# Altium project TIDA-01576_ADS8686S_AFE.PrjPcb (part 2 of 4)

## Sheet TIDA-01576_ADS8686S_AFE_Pg4-5V-15V Split rail converter.SchDoc: 5V-15V Split rail concerter
size 431 x 279 mm; Date: Not shown in title block; ApprovedBy: Not shown in title block; CheckedBy: Not shown in title block; Author: Not shown in title block; CompanyName: Not shown in title block; DrawnBy: Sreenivasa; Engineer: Not shown in title block; Organization: Not shown in title block; Address1: Not shown in title block; Address2: Not shown in title block; Address3: Not shown in title block; Address4: Not shown in title block; DocumentNumber: 1; Revision: Use project parameter SCH_Rev; SheetNumber: 4; SheetTotal: 7; PageSetup: Record=PageOptions|CenterHorizontal=True|CenterVertical=True|PrintScale=1.00|XCorrection=1.00|YCorrection=1.00|PrintKind=0|BorderSize=5000000|LeftOffset=0|BottomOffset=0|Orientation=2|PaperLength=1000|PaperWidth=1000|Scale=100|PaperSource=15|PrintQuality=600|MediaType=1|DitherType=10|PaperKind=Letter|PrintScaleMode=1; CurrentTime: Not shown in title block; CurrentDate: Not shown in title block; Time: Not shown in title block; DocumentFullPathAndName: Not shown in title block; DocumentName: Not shown in title block; ModifiedDate: Not shown in title block; ImagePath: Not shown in title block
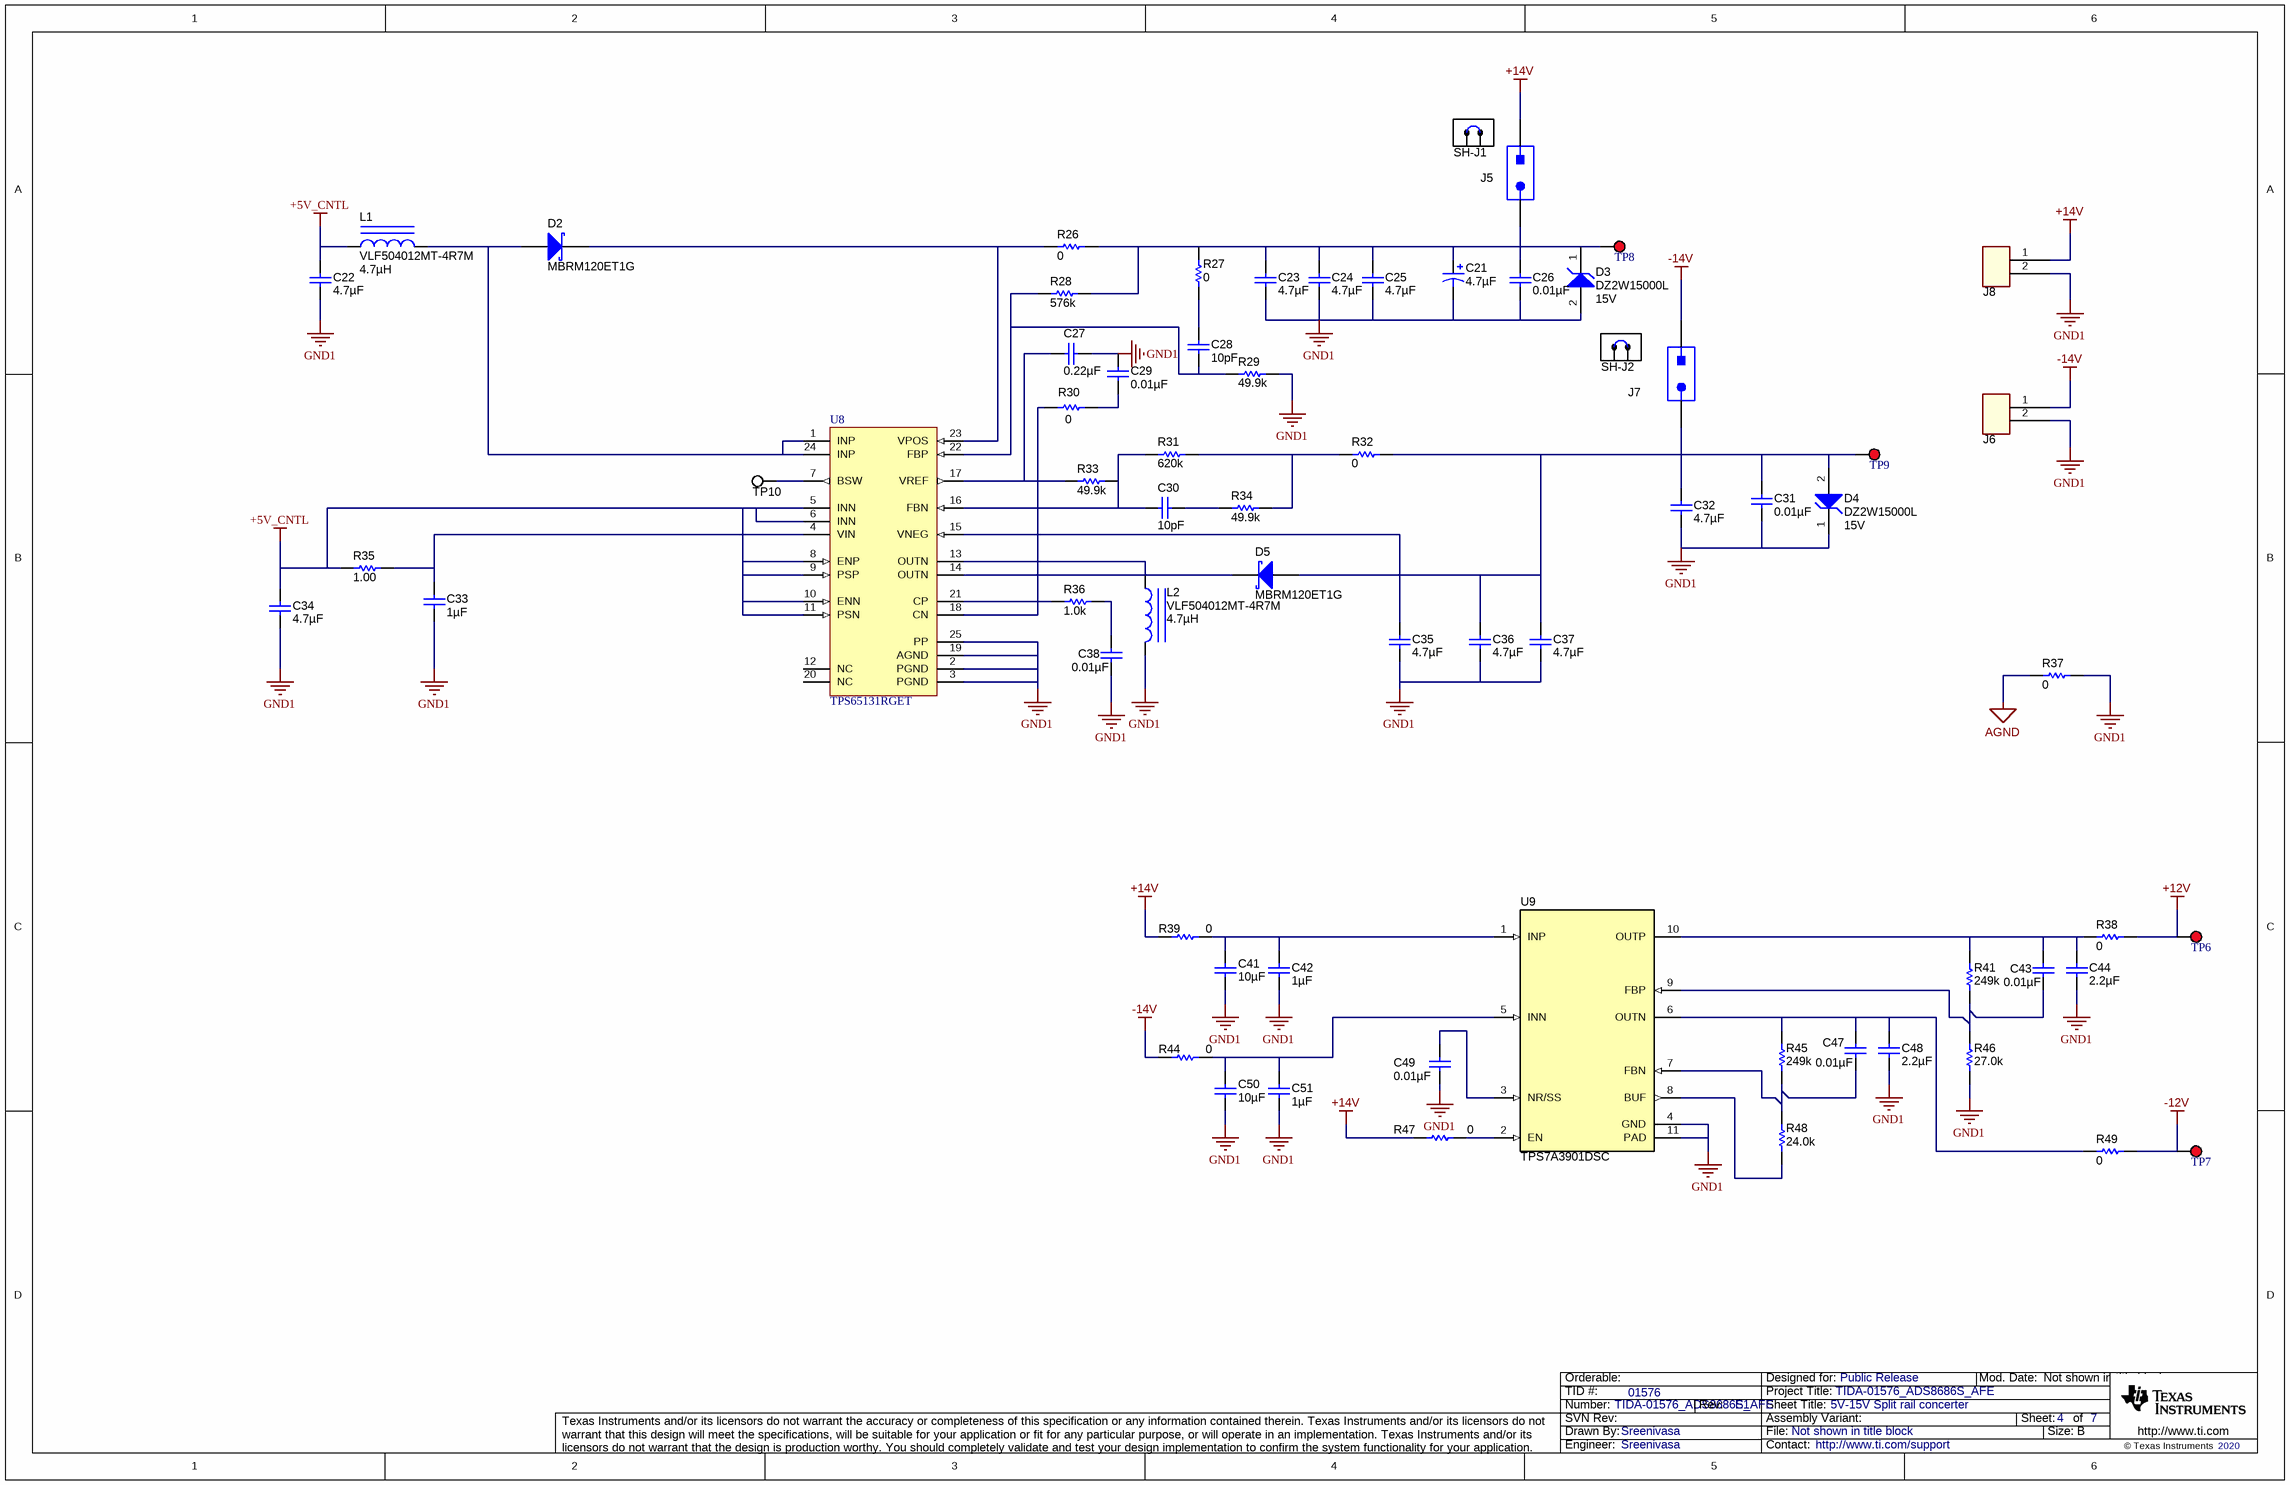
[diagram p3: TIDA-01576_ADS8686S_AFE_Pg4-5V-15V Split rail converter.SchDoc]

### Parts
C21  ValueDisplayed: 4.7µF  [6032-28]  (hidden comment: 293D475X9025C2TE3)
C22  ValueDisplayed: 4.7µF  [1206]  (hidden comment: C3216X7R1E475M160AC)
C23  ValueDisplayed: 4.7µF  [1206]  (hidden comment: C3216X7R1E475M160AC)
C24  ValueDisplayed: 4.7µF  [1206]  (hidden comment: C3216X7R1E475M160AC)
C25  ValueDisplayed: 4.7µF  [1206]  (hidden comment: C3216X7R1E475M160AC)
C26  ValueDisplayed: 0.01µF  [0603]  (hidden comment: GRM188R70J103KA01D)
C27  ValueDisplayed: 0.22µF  [0603]  (hidden comment: C0603C224K9RACTU)
C28  ValueDisplayed: 10pF  [0603]  (hidden comment: C0603C100J5GACTU)
C29  ValueDisplayed: 0.01µF  [0603]  (hidden comment: GRM188R70J103KA01D)
C30  ValueDisplayed: 10pF  [0603]  (hidden comment: C0603C100J5GACTU)
C31  ValueDisplayed: 0.01µF  [0603]  (hidden comment: GRM188R70J103KA01D)
C32  ValueDisplayed: 4.7µF  [1206]  (hidden comment: C3216X7R1E475M160AC)
C33  ValueDisplayed: 1µF  [0603]  (hidden comment: GRM188R61E105KA12D)
C34  ValueDisplayed: 4.7µF  [1206]  (hidden comment: C3216X7R1E475M160AC)
C35  ValueDisplayed: 4.7µF  [1206]  (hidden comment: C3216X7R1E475M160AC)
C36  ValueDisplayed: 4.7µF  [1206]  (hidden comment: C3216X7R1E475M160AC)
C37  ValueDisplayed: 4.7µF  [1206]  (hidden comment: C3216X7R1E475M160AC)
C38  ValueDisplayed: 0.01µF  [0603]  (hidden comment: GRM188R70J103KA01D)
C41  ValueDisplayed: 10µF  [1210]
C42  ValueDisplayed: 1µF  [0603]  (hidden comment: GRM188R61E105KA12D)
C43  ValueDisplayed: 0.01µF  [0603]  (hidden comment: GRM188R70J103KA01D)
C44  ValueDisplayed: 2.2µF  [0805_HV]  (hidden comment: C0805C225K8RACTU)
C47  ValueDisplayed: 0.01µF  [0603]  (hidden comment: GRM188R70J103KA01D)
C48  ValueDisplayed: 2.2µF  [0805_HV]  (hidden comment: C0805C225K8RACTU)
C49  ValueDisplayed: 0.01µF  [0603]  (hidden comment: GRM188R70J103KA01D)
C50  ValueDisplayed: 10µF  [1210]
C51  ValueDisplayed: 1µF  [0603]  (hidden comment: GRM188R61E105KA12D)
D2  MBRM120ET1G  [POWERMITE]
D3  DZ2W15000L  value 15V  [SOD-123]
D4  DZ2W15000L  value 15V  [SOD-123]
D5  MBRM120ET1G  [POWERMITE]
J5  5-146280-2  [TSW-102-07-G-S]  (value not drawn)
J6  CON-OSTVN02A150  [CN2_MTB_P100_PD80_D1.1_S5.54X6.5_STACK]  (value not drawn)
J7  5-146280-2  [TSW-102-07-G-S]  (value not drawn)
J8  CON-OSTVN02A150  [CN2_MTB_P100_PD80_D1.1_S5.54X6.5_STACK]  (value not drawn)
L1  VLF504012MT-4R7M  ValueDisplayed: 4.7µH  [IND_VLF504012]
L2  VLF504012MT-4R7M  ValueDisplayed: 4.7µH  [IND_VLF504012]
R26  value 0  [1206]  (hidden comment: CRCW12060000Z0EA)
R27  ValueDisplayed: 0  [0603]  (hidden comment: CRCW06030000Z0EA)
R28  ValueDisplayed: 576k  [0603]  (hidden comment: CRCW0603576KFKEA)
R29  ValueDisplayed: 49.9k  [0603]  (hidden comment: RG1608P-4992-B-T5)
R30  ValueDisplayed: 0  [0603]  (hidden comment: CRCW06030000Z0EA)
R31  ValueDisplayed: 620k  [0603]  (hidden comment: CRCW0603620KFKEA)
R32  ValueDisplayed: 0  [0603]  (hidden comment: CRCW06030000Z0EA)
R33  ValueDisplayed: 49.9k  [0603]  (hidden comment: RG1608P-4992-B-T5)
R34  ValueDisplayed: 49.9k  [0603]  (hidden comment: RG1608P-4992-B-T5)
R35  ValueDisplayed: 1.00  [0603]  (hidden comment: CR0603-J/-1R0ELF)
R36  ValueDisplayed: 1.0k  [0603]  (hidden comment: CRCW06031K00JNEA)
R37  value 0  [0805_HV]  (hidden comment: CRCW08050000Z0EA)
R38  ValueDisplayed: 0  [0603]  (hidden comment: CRCW06030000Z0EA)
R39  ValueDisplayed: 0  [0603]  (hidden comment: CRCW06030000Z0EA)
R41  ValueDisplayed: 249k  [0603]  (hidden comment: CRCW0603249KFKEA)
R44  ValueDisplayed: 0  [0603]  (hidden comment: CRCW06030000Z0EA)
R45  ValueDisplayed: 249k  [0603]  (hidden comment: CRCW0603249KFKEA)
R46  ValueDisplayed: 27.0k  [0603]  (hidden comment: RC0603FR-0727KL)
R47  ValueDisplayed: 0  [0603]  (hidden comment: CRCW06030000Z0EA)
R48  ValueDisplayed: 24.0k  [0603]  (hidden comment: RC0603FR-0724KL)
R49  ValueDisplayed: 0  [0603]  (hidden comment: CRCW06030000Z0EA)
SH-J1  881545-2  [TE_881545-2]  (value not drawn)  (mechanical)
SH-J2  881545-2  [TE_881545-2]  (value not drawn)  (mechanical)
TP6  5000  [Keystone5000]  (value not drawn)
TP7  5000  [Keystone5000]  (value not drawn)
TP8  5000  [Keystone5000]  (value not drawn)
TP9  5000  [Keystone5000]  (value not drawn)
TP10  5002  [Keystone5002]  (value not drawn)
U8  TPS65131RGET  [RGE0024B]
U9  TPS7A3901DSC  [DSC0010J]

### Nets
+5V_CNTL: C22.1 C34.1 L1.1 R35.1 U8.5(INN) U8.6(INN) U8.8(ENP) U8.9(PSP) U8.10(ENN) U8.11(PSN)
+12V: R38.2 TP6.1
+14V: J5.1 J8.1 R39.1 R47.1
-12V: R49.2 TP7.1
-14V: J6.1 J7.1 R44.1
AGND: R37.1
GND1: C21.2(-) C22.2 C23.2 C24.2 C25.2 C26.2 C27.1 C29.1 C31.2 C32.2 C33.2 C34.2 C35.2 C36.2 C37.2 C38.2 C41.1 C42.2 C44.2 C48.2 C49.2 C50.1 C51.2 D3.2(A) D4.1(K) J6.2 J8.2 L2.2 R29.2 R37.2 R46.1 U8.2(PGND) U8.3(PGND) U8.19(AGND) U8.25(PP) U9.4(GND) U9.11(PAD)
NetC21_1: C21.1(+) C23.1 C24.1 C25.1 C26.1 D3.1(K) J5.2 R26.2 R27.2 R28.2 TP8.1
NetC27_2: C27.2 R33.1 U8.17(VREF)
NetC28_1: C28.1 R27.1
NetC28_2: C28.2 R28.1 R29.1 U8.22(FBP)
NetC29_2: C29.2 R30.2
NetC30_1: C30.1 R34.1
NetC30_2: C30.2 R31.1 R33.2 U8.16(FBN)
NetC31_1: C31.1 C32.1 C35.1 C36.1 C37.1 D4.2(A) D5.2(A) J7.2 R32.2 TP9.1 U8.15(VNEG)
NetC33_1: C33.1 R35.2 U8.4(VIN)
NetC38_1: C38.1 R36.2
NetC41_2: C41.2 C42.1 R39.2 U9.1(INP)
NetC43_1: C43.1 C44.1 R38.1 R41.2 U9.10(OUTP)
NetC43_2: C43.2 R41.1 R46.2 U9.9(FBP)
NetC47_1: C47.1 C48.1 R45.2 R49.1 U9.6(OUTN)
NetC47_2: C47.2 R45.1 R48.2 U9.7(FBN)
NetC49_1: C49.1 U9.3(NR/SS)
NetC50_2: C50.2 C51.1 R44.2 U9.5(INN)
NetD2_1: D2.1(K) R26.1 U8.23(VPOS)
NetD2_2: D2.2(A) L1.2 U8.1(INP) U8.24(INP)
NetD5_1: D5.1(K) L2.1 U8.13(OUTN) U8.14(OUTN)
NetR30_1: R30.1 U8.18(CN)
NetR31_2: R31.2 R32.1 R34.2
NetR36_1: R36.1 U8.21(CP)
NetR47_2: R47.2 U9.2(EN)
NetR48_1: R48.1 U9.8(BUF)
NetTP10_1: TP10.1 U8.7(BSW)

Not connected (* = marked no-connect by the designer): U8 12(NC) 20(NC)

### Notes on the sheet
- Drawn By:
- SVN Rev:
- Number:
- TID #:
- Orderable:
- Rev:
- Sheet Title:
- File:
- Project Title:
- Designed for:
- Assembly Variant:
- Mod. Date:
- Sheet:
- Size:
- of
- B
- http://www.ti.com
- Texas Instruments and/or its licensors do not warrant the accuracy or completeness of this specification or any information contained therein. Texas Instruments and/or its licensors do not warrant that this design will meet the specifications, will be suitable for your application or fit for any particular purpose, or will operate in an implementation. Texas Instruments and/or its licensors do not warrant that the design is production worthy. You should completely validate and test your design implementation to confirm the system functionality for your application.
- Engineer:
- Contact:
- © Texas Instruments

### Library data of the parts
C21 = 293D475X9025C2TE3: CAP, TA, 4.7 µF, 25 V, +/- 10%, 2 ohm, SMD; Manufacturer: Vishay-Sprague; Polarized: Y; CompType: Capacitor; Value: 4.7uF; U/M: EA; Cap_F: 0.0000047; Tolerance_%: 10; Value1: 2 ohm; VDC_V: 25; Value2: 25V; ESR_ohm: 2; IRMS_A: 0.24; TaMin_C: -55; TaMax_C: 125; Cap_Case: C; SymbolVersion: 2008-07-09; PartNumber: 293D475X9025C2TE3; PackageReference: 6032-28; RoHS: Y; MountType: SMT; Technology: TA; Series: 293D; Publisher: Texas Instruments; LatestRevisionDate: 2014-11-20; LatestRevisionNote: Updated supplier links; ComponentLink1Description: Datasheet link; ComponentLink1URL: http://www.vishay.com/docs/40002/293d.pdf; Supplier 1: Digi-Key; Supplier Part Number 1: 718-1082-1-ND; Supplier 2: Mouser; Supplier Part Number 2: 74-293D475X9025C2TE3; Supplier 3: Farnell; Supplier Part Number 3: 1754216
C22-C25 C32 C34-C37 = C3216X7R1E475M: CAP, CERM, 4.7 µF, 25 V, +/- 20%, X7R, 1206; Manufacturer: TDK; Polarized: N; CompType: Capacitor; Value: 4.7uF; U/M: EA; Cap_F: 0.0000047; Tolerance_%: 20; ESR_ohm: 0.0063; Value1: 0.0063 ohm; VDC_V: 25; Value2: 25V; TaMin_C: -55; TaMax_C: 125; SymbolVersion: 2008-07-09; PartNumber: C3216X7R1E475M160AC; PackageReference: 1206; RoHS: Y; MountType: SMT; Technology: Ceramic; TempCo: X7R; Cap_Case: 1206; Published: 2008-06-19; Publisher: Texas Instruments; LatestRevisionDate: 2015-02-10; ComponentLink1Description: Datasheet link; ComponentLink1URL: http://www.tdk.co.jp/tefe02/e412_c.pdf; Supplier 1: Digi-Key; Supplier Part Number 1: 445-1424-1-ND; Supplier 2: Farnell; Supplier Part Number 2: 1844330
C26 C29 C31 C38 C43 C47 C49 = GRM188R70J103KA01D: CAP, CERM, 0.01 µF, 6.3 V, +/- 10%, X7R, 0603; Manufacturer: MuRata; Polarized: N; CompType: Capacitor; Value: 0.01uF; U/M: EA; Cap_F: 0.00000001; Tolerance_%: 10; Value1: Unknown; VDC_V: 6.3; Value2: 6.3V; TaMin_C: -55; TaMax_C: 125; SymbolVersion: 2008-07-09; PartNumber: GRM188R70J103KA01D; PackageReference: 0603; RoHS: Y; MountType: SMT; Technology: Ceramic; TempCo: X7R; Cap_Case: 0603; Published: 2008-06-19; Publisher: Texas Instruments; LatestRevisionDate: 2015-02-10; ComponentLink1Description: Datasheet link; ComponentLink1URL: http://search.murata.co.jp/Ceramy/PnsearchViewAction.do?HnOFG=ON&HnNFG=ON&SEL_CNT=50&sLang=en&sKey=GRM188R70J103KA01D&x=9&y=9&search=startwith; Supplier 1: Digi-Key; Supplier Part Number 1: 490-9729-1-ND; Supplier 2: Mouser; Supplier Part Number 2: 81-GRM188R70J103KA1D
C27 = C0603C224K4RACTU: CAP, CERM, 0.22 µF, 6.3 V, +/- 10%, X7R, 0603; Manufacturer: Kemet; Polarized: N; CompType: Capacitor; Value: 0.22uF; U/M: EA; Cap_F: 0.00000022; Tolerance_%: 10; Value1: Unknown; VDC_V: 16; Value2: 16V; TaMin_C: -55; TaMax_C: 125; SymbolVersion: 2008-07-09; PartNumber: C0603C224K9RACTU; PackageReference: 0603; RoHS: Y; MountType: SMT; Technology: Ceramic; TempCo: X7R; Cap_Case: 0603; Published: 2008-06-19; Publisher: Texas Instruments; LatestRevisionDate: 2014-05-15; ComponentLink1Description: Datasheet link; ComponentLink1URL: http://www.kemet.com/kemet/web/homepage/kechome.nsf/vapubfiles/F3102_Y5V.pdf/$file/F3102_Y5V.pdf; Supplier 1: Digi-Key; Supplier Part Number 1: 399-9046-1-ND; Supplier 2: Mouser; Supplier Part Number 2: 80-C0603C224K4R; Supplier 3: Farnell; Supplier Part Number 3: 1650007
C28 C30 = C0603C100J5GACTU: CAP, CERM, 10 pF, 50 V, +/- 5%, C0G/NP0, 0603; Manufacturer: Kemet; Polarized: N; CompType: Capacitor; Value: 10pF; U/M: EA; Cap_F: 0.00000000001; Tolerance_%: 5; Value1: Unknown; VDC_V: 50; Value2: 50V; TaMin_C: -55; TaMax_C: 125; SymbolVersion: 2008-07-09; PartNumber: C0603C100J5GACTU; PackageReference: 0603; RoHS: Y; MountType: SMT; Technology: Ceramic; TempCo: C0G/NP0; Cap_Case: 0603; Published: 2008-06-19; Publisher: Texas Instruments; LatestRevisionDate: 2015-02-10; ComponentLink1Description: Datasheet link; ComponentLink1URL: http://www.kemet.com/kemet/web/homepage/kechome.nsf/vapubfiles/F3102_Y5V.pdf/$file/F3102_Y5V.pdf; Supplier 1: Digi-Key; Supplier Part Number 1: 399-1049-1-ND; Supplier 2: Mouser; Supplier Part Number 2: 80-C0603C100J5G; Supplier 3: Farnell; Supplier Part Number 3: 1414601
C33 C42 C51 = GRM188R61E105KA12D: CAP, CERM, 1 µF, 25 V, +/- 10%, X5R, 0603; Manufacturer: MuRata; Polarized: N; CompType: Capacitor; Value: 1uF; U/M: EA; Cap_F: 0.000001; Tolerance_%: 10; Value1: Unknown; VDC_V: 25; Value2: 25V; TaMin_C: -55; TaMax_C: 85; SymbolVersion: 2008-07-09; PartNumber: GRM188R61E105KA12D; PackageReference: 0603; RoHS: Y; MountType: SMT; Technology: Ceramic; TempCo: X5R; Cap_Case: 0603; Published: 2008-06-19; Publisher: Texas Instruments; LatestRevisionDate: 2015-02-10; ComponentLink1Description: Datasheet link; ComponentLink1URL: http://search.murata.co.jp/Ceramy/PnsearchViewAction.do?HnOFG=ON&HnNFG=ON&SEL_CNT=50&sLang=en&sKey=GRM188R61E105KA12D&x=9&y=9&search=startwith; Supplier 1: Digi-Key; Supplier Part Number 1: 490-3897-1-ND; Supplier 2: Mouser; Supplier Part Number 2: 81-GRM188R61E105KA12; Supplier 3: Farnell; Supplier Part Number 3: 1828802
C41 C50 = GMK325AB7106MM-T: CAP, CERM, 10uF, 35V, +/-20%, X7R, 1210; Manufacturer: Taiyo Yuden; Polarized: N; CompType: Capacitor; U/M: EA; Cap_F: 0.00001; Tolerance_%: 20; Value1: Unknown; VDC_V: 35; TaMin_C: -55; TaMax_C: 125; PackageReference: 1210; PartNumber: GMK325AB7106MM-T; SymbolVersion: 2008-07-09; Value: 10uF; RoHS: Y; Value2: 35V; MountType: SMT; Technology: Ceramic; Cap_Case: 1210; Publisher: Texas Instruments; LatestRevisionDate: 2013-12-06; ComponentLink1Description: Datasheet link; ComponentLink1URL: http://www.yuden.co.jp/productdata/catalog/en/mlcc01_e.pdf; Supplier 1: Digi-Key; Supplier Part Number 1: 587-2779-1-ND; Supplier 2: Mouser; Supplier Part Number 2: 963-GMK325AB7106MM-T; Supplier 3: Farnell; Supplier Part Number 3: 1894510; TempCo: X7R; Published: 2008-06-19
C44 C48 = C0805C225K8RACTU: CAP, CERM, 2.2uF, 10V, +/-10%, X7R, 0805; Manufacturer: Kemet; Polarized: N; CompType: Capacitor; U/M: EA; Cap_F: 0.0000022; Tolerance_%: 10; ESR_Ohm: 0.008; Value1: 0.008 ohm; IRMS_A: 15.55; TaMin_C: -55; TaMax_C: 125; Cap_Case: 0805; SymbolVersion: 2008-07-09; Value: 2.2uF; PartNumber: C0805C225K8RACTU; PackageReference: 0805; RoHS: Y; VDC_V: 10; Value2: 10V; MountType: SMT; Technology: Ceramic; TempCo: X7R; Published: 2008-06-19; Publisher: Texas Instruments; LatestRevisionDate: 2014-05-28; ComponentLink1Description: Datasheet link; ComponentLink1URL: http://www.kemet.com/kemet/web/homepage/kechome.nsf/file/Partial%20Copy%20-%20Ceramic%20Surface%20Mount%20Capacitors/$file/F3102_CE.pdf; Supplier 1: Digi-Key; Supplier Part Number 1: 399-3522-1-ND; Supplier 2: Mouser; Supplier Part Number 2: 80-C0805C225K8R
D2 D5 = MBRM120ET1G: Diode, Schottky, 20 V, 1 A, POWERMITE; Manufacturer: ON Semiconductor; U/M: EA; Vf_V: 0.53; Value: 20V; Value1: 1A; Value2: 0.53V; Io_A: 1; Vr_V: 20; CompType: Diode; SymbolVersion: 2008-12-08; PartNumber: MBRM120ET1G; PackageReference: POWERMITE; MountType: SMT; Type: Schottky; Published: 2008-06-26; Publisher: Texas Instruments; LatestRevisionDate: 2015-02-10; ComponentLink1Description: Datasheet link; ComponentLink1URL: http://www.onsemi.com/pub_link/Collateral/MBRM120E-D.PDF; Supplier 1: Digi-Key; Supplier Part Number 1: MBRM120ET3GOSCT-ND
D3 D4 = DZ2W15000L: Diode, Zener, 15V, 1W, SOD-123; Manufacturer: Panasonic; CompType: Zener; PartNumber: DZ2W15000L; PackageReference: SOD-123; MountType: SMT; RoHS: Y; ComponentLink1Description: Datasheet link; ComponentLink1URL: http://www.semicon.panasonic.co.jp/ds4/DZ2W150_E.pdf; Publisher: Texas Instruments; Supplier 1: Digi-Key; Supplier Part Number 1: DZ2W15000LCT-ND
J5 J7 = TSW-102-07-G-S: Header, 100mil, 2x1, Gold, TH; Manufacturer: TE Connectivity; SymbolCreator: a0412235; U/M: EA; SymbolVersion: 2013-10-31; PartNumber: 5-146280-2; ClassName: Header; PackageReference: 2x1 Header; CompType: Header; RoHS: Y; MountType: TH; ComponentLink1Description: Datasheet Link; ComponentLink1URL: http://samtec.com/ftppub/pdf/TSW_TH.PDF; Publisher: Texas Instruments; LatestRevisionDate: 2015-10-21; Supplier 1: Digi-Key; Supplier Part Number 1: A121480-ND
J6 J8 = CON-OSTVN02A150: Terminal Block, 4x1, 2.54mm, TH; Manufacturer: On Shore Technology Inc; SymbolCreator: x0120606; PartNumber: OSTVN02A150; CompType: Terminal Block; Publisher: TI; Alternate Manufacturer: *; PackageReference: TERM_BLK, 2pos, 2.54mm; Supplier 1: Digi-Key; RoHS: Y; MountType: TH; ComponentLink1URL: http://www.on-shore.com/sites/default/files/manuals/ostvnxxa150.pdf; ComponentLink1Description: Datasheet Link; Alternate PartNumber: *; Supplier Part Number 1: ED10561-ND
L1 L2 = VLF504012MT-4R7M: Inductor, Shielded, Ferrite, 4.7uH, 1.83A, 0.1 ohm, SMD; Manufacturer: TDK; Ind_H: 4.7E-6; Imax_A: 1.83; Irms: 1.83A @ 40C rise; Isat: 1.94A @ 30% inductance drop; DCR_ohm: 0.1; Value1: 0.1 ohm; U/M: EA; SymbolVersion: 2008-07-23; CompType: Inductor; Value: 4.7uH; PartNumber: VLF504012MT-4R7M; PackageReference: IND_5x1.2x4mm; Value2: 1.83A; Technology: Shielded; MountType: SMT; Material: Ferrite; Published: 2008-06-26; Publisher: Texas Instruments; LatestRevisionDate: 2013-10-24; ComponentLink1Description: Datasheet link; ComponentLink1URL: http://www.tdk.co.jp/tefe02/e531_vlf.pdf; RoHS: Y; Supplier 1: Digi-Key; Supplier Part Number 1: 445-17203-1-ND
R26 = CRCW12060000Z0EA: RES, 0 ohm, 5%, 0.25W, 1206; Manufacturer: Vishay-Dale; CompType: Resistor; Value_Code: 0000; Tolerance_%: 5; Power_W: 0.25; VDC_V: 200; TempCo: 200 ppm/C; EIA_Code: E24; U/M: EA; SymbolVersion: 2009-05-29; PartNumber: CRCW12060000Z0EA; PackageReference: 1206; RoHS: Y; Res_ohm: 0; Value1: 5%; Value2: 0.25W; MountType: SMT; Technology: Thick Film; Published: 2008-06-26; Publisher: Texas Instruments; LatestRevisionDate: 2013-10-09; ComponentLink1Description: Datasheet link; ComponentLink1URL: http://www.vishay.com/docs/20035/dcrcwe3.pdf; Supplier 1: Digi-Key; Supplier Part Number 1: 541-0.0ECT-ND; Supplier 2: Mouser; Supplier Part Number 2: 71-CRCW1206-0-E3; Supplier 3: Farnell; Supplier Part Number 3: 1469963
R27 R30 R32 R38 R39 R44 R47 R49 = CRCW06030000Z0EA: RES, 0, 5%, 0.1 W, 0603; Manufacturer: Vishay-Dale; CompType: Resistor; Value: 0; Value_Code: 0000; Tolerance_%: 5; Power_W: 0.1; Value2: 0.1W; VDC_V: 75; TempCo: 200 ppm/C; EIA_Code: E24; U/M: EA; SymbolVersion: 2009-05-29; PartNumber: CRCW06030000Z0EA; PackageReference: 0603; RoHS: Y; Res_ohm: 0; Value1: 5%; MountType: SMT; Technology: Thick Film; Published: 2008-06-26; Publisher: Texas Instruments; LatestRevisionDate: 2014-12-16; ComponentLink1Description: Datasheet link; ComponentLink1URL: http://www.vishay.com/docs/20035/dcrcwe3.pdf; Supplier 1: Digi-Key; Supplier Part Number 1: 541-0.0GCT-ND; Supplier 2: Mouser; Supplier Part Number 2: 71-CRCW0603-0-E3; Supplier 3: Farnell; Supplier Part Number 3: 1469739
R28 = CRCW0603576KFKEA: RES, 576 k, 1%, 0.1 W, 0603; Manufacturer: Vishay-Dale; CompType: Resistor; Value: 576k; Res_ohm: 576000; Tolerance_%: 1; Power_W: 0.1; Value2: 0.1W; VDC_V: 75; TempCo: 100 ppm/C; EIA_Code: E96; U/M: EA; SymbolVersion: 2009-05-29; PartNumber: CRCW0603576KFKEA; PackageReference: 0603; RoHS: Y; Value_Code: 576k; Value1: 1%; MountType: SMT; Technology: Thick Film; Published: 2008-06-26; Publisher: Texas Instruments; LatestRevisionDate: 2014-12-16; ComponentLink1Description: Datasheet link; ComponentLink1URL: http://www.vishay.com/docs/20035/dcrcwe3.pdf; Supplier 1: Digi-Key; Supplier Part Number 1: 541-576KHCT-ND; Supplier 2: Mouser; Supplier Part Number 2: 71-CRCW0603-576K-E3; Supplier 3: Farnell; Supplier Part Number 3: 1878635
R29 R33 R34 = RG1608P-4992-B-T5: RES, 49.9 k, 0.1%, 0.1 W, 0603; Manufacturer: Susumu Co Ltd; CompType: Resistor; Value: 49.9k; Res_ohm: 49900; Value_Code: 49k9; Tolerance_%: 0.1; Value2: 0.1W; VDC_V: 75; TempCo: 25 ppm/C; EIA_Code: E192; U/M: EA; SymbolVersion: 2009-05-29; PartNumber: RG1608P-4992-B-T5; PackageReference: 0603; RoHS: Y; Value1: 0.1%; Power_W: 0.1; MountType: SMT; Technology: Metal Film; Published: 2008-06-26; Publisher: Texas Instruments; LatestRevisionDate: 2014-12-16; ComponentLink1Description: Datasheet link; ComponentLink1URL: http://www.susumu.co.jp/english/pdf/products-j01-01.pdf; Supplier 1: Digi-Key; Supplier Part Number 1: RG16P49.9KBCT-ND; Supplier 2: Mouser; Supplier Part Number 2: 754-RG1608P-4992-BT5; Supplier 3: Farnell; Supplier Part Number 3: 9367926
R31 = RC0603FR-07620KL: RES SMD 620K OHM 1% 1/10W 0603; Manufacturer: Vishay-Dale; CompType: Resistor; Res_ohm: 620000; Tolerance_%: 1; Power_W: 0.1; Value2: 0.1W; VDC_V: 150; TempCo: 200 ppm/C; U/M: EA; SymbolVersion: 2009-05-29; Value: 620k; PartNumber: CRCW0603620KFKEA; PackageReference: 0603; RoHS: Y; Value_Code: 620k; Value1: 1%; MountType: SMT; Technology: Thick Film; Published: 2008-06-26; Publisher: Texas Instruments; LatestRevisionDate: 2014-12-16; ComponentLink1Description: Datasheet link; ComponentLink1URL: http://www.yageo.com/pdf/Pu-RC0603_51_PbFree_L_2.pdf; Supplier 1: Digi-Key; Supplier Part Number 1: 541-620KHCT-ND; Supplier 2: Mouser; Supplier Part Number 2: 603-RC0603FR-07620KL
R35 = RT0603DRE071RL: RES SMD 1 OHM 5% 1/10W 0603; Manufacturer: Bourns inc; CompType: Resistor; Value: 1.00; Res_ohm: 1; Value_Code: 1R00; Tolerance_%: 0.5; Value1: 0.5%; Power_W: 0.1; Value2: 0.1W; VDC_V: 75; TempCo: 50 ppm/C; EIA_Code: E192; U/M: EA; SymbolVersion: 2009-05-29; PartNumber: CR0603-J/-1R0ELF; PackageReference: 0603; RoHS: Y; MountType: SMT; Technology: Thin Film; Published: 2008-06-26; Publisher: Texas Instruments; LatestRevisionDate: 2014-12-16; ComponentLink1Description: Datasheet link; ComponentLink1URL: http://www.yageo.com/pdf/PYu-RT_1-to-0.05_RoHS_L_3.pdf; Supplier 1: Digi-Key; Supplier Part Number 1: CR0603-J/-1R0ELFCT-ND
R36 = CRCW06031K00JNEA: RES, 1.0 k, 5%, 0.1 W, 0603; Manufacturer: Vishay-Dale; CompType: Resistor; Value: 1.0k; Res_ohm: 1000; Value_Code: 1k00; Tolerance_%: 5; Power_W: 0.1; Value2: 0.1W; VDC_V: 75; TempCo: 200 ppm/C; EIA_Code: E24; U/M: EA; SymbolVersion: 2009-05-29; PartNumber: CRCW06031K00JNEA; PackageReference: 0603; RoHS: Y; Value1: 5%; MountType: SMT; Technology: Thick Film; Published: 2008-06-26; Publisher: Texas Instruments; LatestRevisionDate: 2014-12-16; ComponentLink1Description: Datasheet link; ComponentLink1URL: http://www.vishay.com/docs/20035/dcrcwe3.pdf; Supplier 1: Digi-Key; Supplier Part Number 1: 541-1.0KGCT-ND; Supplier 2: Mouser; Supplier Part Number 2: 71-CRCW0603J-1.0K-E3; Supplier 3: Farnell; Supplier Part Number 3: 1652851
R37 = CRCW0805330KJNEA: RES, 0 ohm, 5%, 0.125W, 0805; Manufacturer: Vishay-Dale; CompType: Resistor; Tolerance_%: 5; Power_W: 0.125; VDC_V: 150; TempCo: 200 ppm/C; EIA_Code: E24; U/M: EA; SymbolVersion: 2009-05-29; PartNumber: CRCW08050000Z0EA; PackageReference: 0805; RoHS: Y; Res_ohm: 0; Value_Code: 0; Value1: 5%; Value2: 0.125W; MountType: SMT; Technology: Thick Film; Published: 2008-06-26; Publisher: Texas Instruments; LatestRevisionDate: 2014-04-18; ComponentLink1Description: Datasheet link; ComponentLink1URL: http://www.vishay.com/docs/20035/dcrcwe3.pdf; Supplier 1: Digi-Key; Supplier Part Number 1: 541-0.0ACT-ND
R41 R45 = CRCW0603249KFKEA: RES, 249 k, 1%, 0.1 W, 0603; Manufacturer: Vishay-Dale; CompType: Resistor; Value: 249k; Res_ohm: 249000; Tolerance_%: 1; Power_W: 0.1; Value2: 0.1W; VDC_V: 75; TempCo: 100 ppm/C; SizeArea_mm2: 1.28; SizeX_mm: 1.6; SizeY_mm: 0.8; EIA_Code: E96; U/M: EA; AEC Category: Q200; SymbolVersion: 2009-05-29; PartNumber: CRCW0603249KFKEA; PackageReference: 0603; RoHS: Y; Value_Code: 249k; Value1: 1%; MountType: SMT; Technology: Thick Film; SizeZ_mm: 1; Published: 2008-06-26; Publisher: Texas Instruments; LatestRevisionDate: 2016-06-29; ComponentLink1Description: Datasheet link; ComponentLink1URL: http://www.vishay.com/docs/20035/dcrcwe3.pdf; Supplier 1: Digi-Key; Supplier Part Number 1: 541-249KHCT-ND; Supplier 2: Mouser; Supplier Part Number 2: 71-CRCW0603-249K-E3; Supplier 3: Farnell; Supplier Part Number 3: 1469787; AEC Qualified: ?
R46 = RC0603FR-0727KL: RES, 27.0 k, 1%, 0.1 W, 0603; Manufacturer: Yageo America; CompType: Resistor; Value: 27.0k; Res_ohm: 27000; Value_Code: 27k0; Tolerance_%: 1; Power_W: 0.1; Value2: 0.1W; VDC_V: 150; TempCo: 200 ppm/C; SizeArea_mm2: 1.28; SizeX_mm: 1.6; SizeY_mm: 0.8; U/M: EA; AEC Category: Q200; Green_Lifecycle: Active; Green_REACh: Passed; SymbolVersion: 2009-05-29; PartNumber: RC0603FR-0727KL; PackageReference: 0603; RoHS: Y; Value1: 1%; MountType: SMT; Technology: Thick Film; SizeZ_mm: 1; Published: 2008-06-26; Publisher: Texas Instruments; LatestRevisionDate: 2017-05-31; ComponentLink1Description: Datasheet link; ComponentLink1URL: http://www.yageo.com/pdf/Pu-RC0603_51_PbFree_L_2.pdf; Supplier 1: Digi-Key; Supplier Part Number 1: 311-27.0KHRCT-ND; Supplier 2: Mouser; Supplier Part Number 2: 603-RC0603FR-0727KL; Supplier 3: Farnell; Supplier Part Number 3: 9238654; AEC Qualified: ?; Green_EU RoHS: Passed with Exemption; Green_EU RoHS-2: Passed
R48 = RC0603FR-0724KL: RES, 24.0 k, 1%, 0.1 W, 0603; Manufacturer: Yageo America; CompType: Resistor; Value: 24.0k; Res_ohm: 24000; Value_Code: 24k0; Tolerance_%: 1; Power_W: 0.1; Value2: 0.1W; VDC_V: 150; TempCo: 200 ppm/C; SizeArea_mm2: 1.28; SizeX_mm: 1.6; SizeY_mm: 0.8; U/M: EA; AEC Category: Q200; Green_Lifecycle: Active; Green_REACh: Passed; SymbolVersion: 2009-05-29; PartNumber: RC0603FR-0724KL; PackageReference: 0603; RoHS: Y; Value1: 1%; MountType: SMT; Technology: Thick Film; SizeZ_mm: 1; Published: 2008-06-26; Publisher: Texas Instruments; LatestRevisionDate: 2017-05-31; ComponentLink1Description: Datasheet link; ComponentLink1URL: http://www.yageo.com/pdf/Pu-RC0603_51_PbFree_L_2.pdf; Supplier 1: Digi-Key; Supplier Part Number 1: 311-24.0KHRCT-ND; Supplier 2: Mouser; Supplier Part Number 2: 603-RC0603FR-0724KL; Supplier 3: Farnell; Supplier Part Number 3: 1799336; AEC Qualified: ?; Green_EU RoHS: Passed with Exemption; Green_EU RoHS-2: Passed
SH-J1 SH-J2 = 881545-2: Shunt, 100mil, Gold plated, Black; Manufacturer: TE Connectivity; CompType: Shunt; PartNumber: 881545-2; RoHS: Y; PackageReference: Shunt 2 pos. 100 mil; MountType: N/A; ComponentLink1Description: Datasheet Link; ComponentLink1URL: http://www.te.com/commerce/DocumentDelivery/DDEController?Action=srchrtrv&DocNm=881545&DocType=Customer+Drawing&DocLang=English; Publisher: Texas Instruments; LatestRevisionDate: 2014-09-20; Supplier 1: Digi-Key; Supplier Part Number 1: A26242-ND; Supplier 2: Mouser; Supplier Part Number 2: 571-8815452; Supplier 3: Farnell; Supplier Part Number 3: 1654806
TP6-TP9 = 5000: Test Point, Miniature, Red, TH; Manufacturer: Keystone; CompType: Test Point Loop; ContactFinish: Silver; Green_Lifecycle: Active; Green_REACh: Passed; SymbolVersion: 2008-04-04; PartNumber: 5000; RoHS: Y; PackageReference: Red Miniature Testpoint; MountType: TH; ComponentLink1Description: Datasheet URL; ComponentLink1URL: http://www.keyelco.com/userAssets/file/M60-2p60.pdf; Publisher: Texas Instruments; LatestRevisionDate: 2017-05-11; Supplier 1: Digi-Key; Supplier Part Number 1: 36-5000-ND; Supplier 2: Mouser; Supplier Part Number 2: 534-5000; Color: Red; Green_EU RoHS: Passed; Green_EU RoHS-2: Incomplete
TP10 = 5002: Test Point, Miniature, White, TH; Manufacturer: Keystone; CompType: Test Point Loop; U/M: EA; SymbolVersion: 2008-04-04; PartNumber: 5002; PackageReference: White Miniature Testpoint; RoHS: Y; MountType: TH; ComponentLink1Description: Datasheet Link; ComponentLink1URL: http://www.keyelco.com/userAssets/file/M60-2p60.pdf; Value: White; Publisher: Texas Instruments; LatestRevisionDate: 2015-08-25; Supplier 1: Digi-Key; Supplier Part Number 1: 36-5002-ND; Supplier 2: Newark; Supplier Part Number 2: 82H9632
U8 = TPS65131RGET: Postive and Negative Output DC-DC Converter, 2.7 to 5.5 V, -40 to 85 degC, 24-pin QFN (RGE24), Green (RoHS & no Sb/Br); Manufacturer: Texas Instruments; Alternate Manufacturer: None; Alternate PartNumber: Equivalent; Iq(Typ)(mA): 0.5; Rating: Catalog; SubFamily: LCD/OLED Display Bias Solutions; Switching Frequency(Typ)(kHz): 1400; Synchronous Rectification: TRUE; Topology: Boost, Inverting Buck/Boost; Vin(Max)(V): 5.5; Vin(Min)(V): 2.7; DatasheetVersion: SLVS493B; PackageVersion: 4204104/G; PackageReference: RGE0024B; PackageDescription: 24-Pin Plastic Flat Pack, Body 4 x 4 mm, 0.5 mm Pitch; Supplier 1: Digi-Key; Supplier Part Number 1: 296-41760-1-ND; Supplier 2: Digi-Key; Supplier Part Number 2: 296-17349-1-ND; Supplier 3: Digi-Key; Supplier Part Number 3: 296-17349-6-ND; Supplier 4: Newark; Supplier Part Number 4: 44J2536; Supplier 5: Mouser; Supplier Part Number 5: 595-TPS65131RGET; Eco-Plan: Green (RoHS & no Sb/Br); MountType: SMT; Code_JEDEC: MO-220; PartNumber: TPS65131RGET; ComponentLink1Description: Manufacturer URL; ComponentLink1URL: http://www.ti.com/; ComponentLink2Description: Datasheet; ComponentLink2URL: http://www.ti.com/general/docs/lit/getliterature.tsp?genericPartNumber=TPS65131&fileType=pdf; ComponentLink3Description: Package Specification; ComponentLink3URL: http://www.ti.com/litv/pdf/mpqf124f
U9 = TPS7A3901DSC: Wide-VIN (±33 V), 150-mA, Spilt-Rail Output, Positive and Negative LDO Voltage Regulator with Startup Tracking, DSC0010J; Manufacturer: Texas Instruments; SymbolCreator: Altium; SizeArea_mm2: 9; SizeAreaWB_mm2: 16; SizeX_mm: 3; SizeZ_mm: 0.8; CompType: IC; U/M: EA; SymbolVersion: 2016-01-29; PartNumber: TPS7A3901DSC; PackageReference: DSC0010J; PackageDescription: WSON-10; MountType: SMT; SizeY_mm: 3; ComponentLink1Description: Datasheet Link; ComponentLink1URL: https://sps06.itg.ti.com/sites/KMS/crossdivteams/altium/docs/ComponentDatasheets/SBVS263.pdf; Publisher: Texas Instruments; LatestRevisionDate: 2016-07-20; Alternate Manufacturer: Texas Instruments